# EAGLE design Combined_Board_BMI088 (EAGLE 9.6.2)
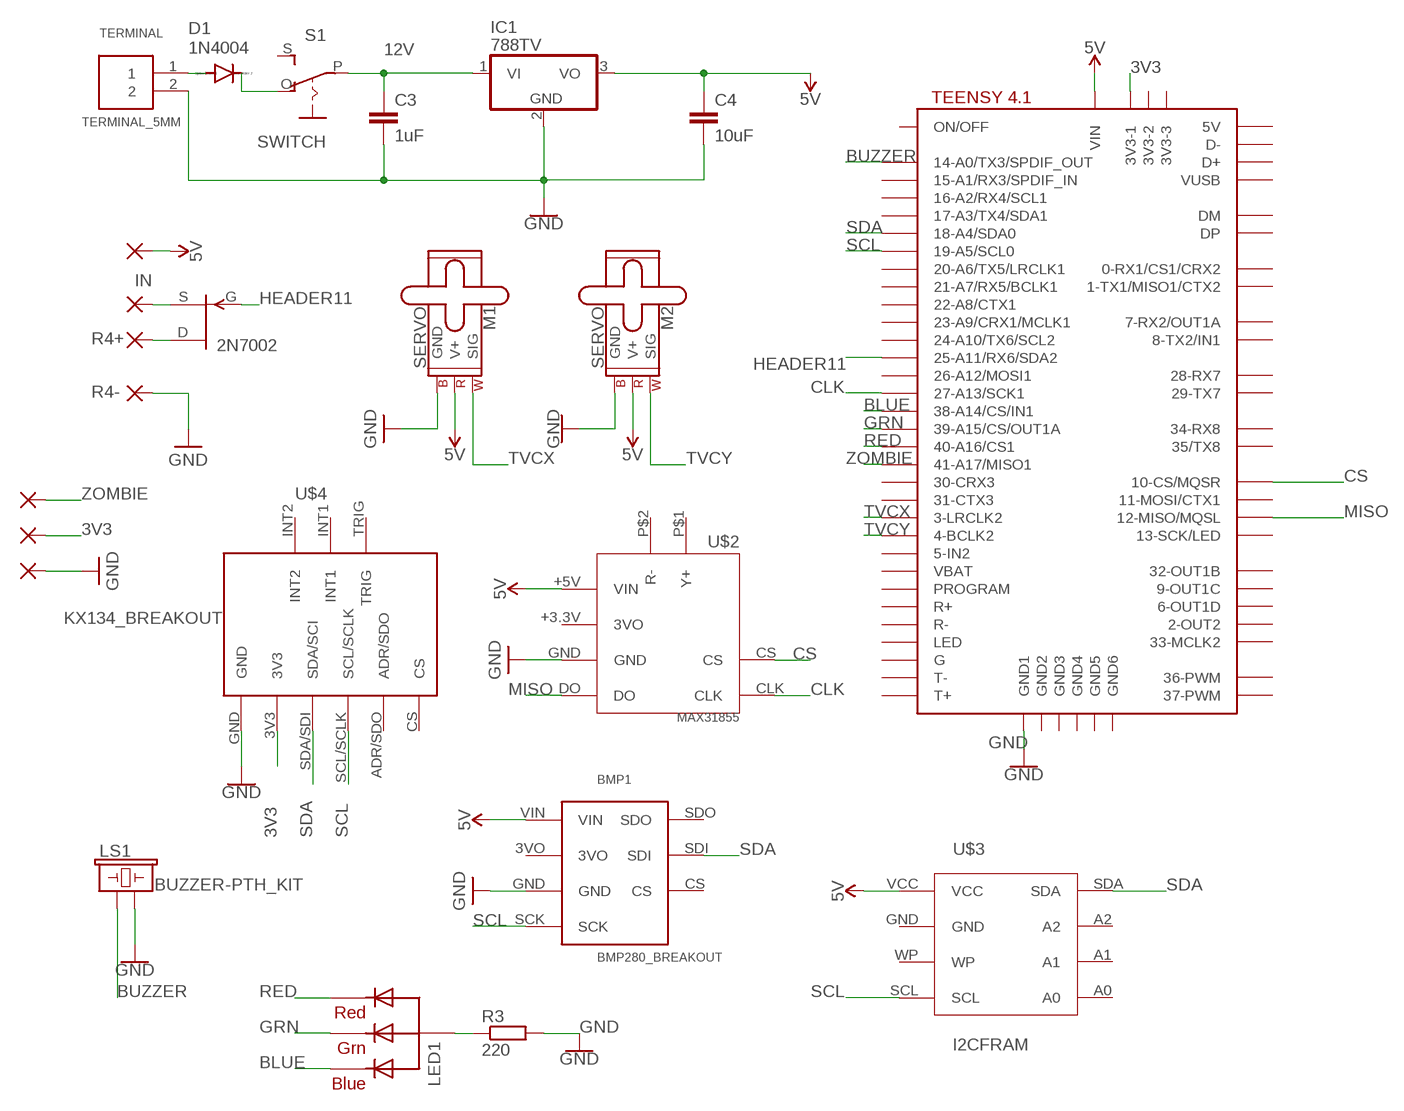
[diagram p0: schematic, sheet 1]

## Parts
2N7002  2N3819  [TO92]
5V  0  1,6/0,8  [1,6/0,8]
BMP1  BMP280_BREAKOUT  [BMP280_BREAKOUT]
C3  1uF  22PF-PTH-2.54MM-200V-5%  [CAP-PTH-2.54]
C4  10uF  22PF-PTH-2.54MM-200V-5%  [CAP-PTH-2.54]
D1  1N4004  [DO41-10]
IC1  788TV  [TO220V]
IN  0  1,6/0,8  [1,6/0,8]
LED1  RGBLED_CA-5MM  [LED5MMRGB]
LS1  BUZZER-PTH_KIT  [BUZZER-12MM-KIT]
M1  SERVO  [1X03]
M2  SERVO  [1X03]
R3  220  R-EU_0204/7  [0204/7]
R4+  0  1,6/0,8  [1,6/0,8]
R4-  0  1,6/0,8  [1,6/0,8]
S1  SWITCH  EG1218S  [EG1218]
TERMINAL  TERMINAL_5MM  [TERMINAL_5MM]
U$1  TEENSY41  [TEENSY41]
U$2  MAX31855  [MAX31855-BREAKOUT]
U$3  I2CFRAM  [I2CFRAM]
U$4  KX134_BREAKOUT  [KX134_BREAKOUT]
ZOMBIE  0  1,6/0,8  [1,6/0,8]
ZOMBIE3V3  0  1,6/0,8  [1,6/0,8]
ZOMBIEGND  0  1,6/0,8  [1,6/0,8]

## Nets
3V3: U$1.3V3-1 U$4.3V3 ZOMBIE3V3.1(P)
5V: 5V.1(P) BMP1.VIN C4.1 IC1.3(VO) M1.2(V+) M2.2(V+) U$1.VIN U$2.+5V(VIN) U$3.VCC
12V: C3.1 IC1.1(VI) S1.P
BLUE: LED1.4(BLUE) U$1.38-A14/CS/IN1
BUZZER: LS1.+ U$1.14-A0/TX3/SPDIF_OUT
CLK: U$1.27-A13/SCK1 U$2.CLK
CS: U$1.10-CS\MQSR(10-CS/MQSR) U$2.CS
GND: BMP1.GND C3.2 C4.2 IC1.2(GND) LS1.- M1.3(GND) M2.3(GND) R3.2 R4-.1(P) TERMINAL.2 U$1.GND1 U$2.GND U$4.GND ZOMBIEGND.1(P)
GRN: LED1.3(GREEN) U$1.39-A15/CS/OUT1A
HEADER11: 2N7002.2(G) U$1.25-A11/RX6/SDA2
IN: 2N7002.3(S) IN.1(P)
MISO: U$1.12-MISO/MQSL U$2.DO
N$1: LED1.2(VCC) R3.1
N$2: D1.A TERMINAL.1
N$3: 2N7002.1(D) R4+.1(P)
N$6: D1.C S1.O
RED: LED1.1(RED) U$1.40-A16/CS1
SCL: BMP1.SCK U$1.19-A5/SCL0 U$3.SCL U$4.SCL/SCLK
SDA: BMP1.SDI U$1.18-A4/SDA0 U$3.SDA U$4.SDA/SDI(SDA/SCI)
TVCX: M1.1(SIG) U$1.3-LRCLK2
TVCY: M2.1(SIG) U$1.4-BCLK2
ZOMBIE: U$1.41-A17/MISO1 ZOMBIE.1(P)
Unconnected: BMP1.3VO BMP1.CS BMP1.SDO S1.S U$1.0-RX1/CS1/CRX2 U$1.1-TX1/MISO1/CTX2 U$1.2-OUT2 U$1.3V3-2 U$1.3V3-3 U$1.5-IN2 U$1.6-OUT1D U$1.7-RX2/OUT1A U$1.8-TX2/IN2(8-TX2/IN1) U$1.9-OUT1C U$1.11-MOSI/CTX1 U$1.13-SCK/LED U$1.15-A1/RX3/SPDIF_IN U$1.16-A2/RX4/SCL1 U$1.17-A3/TX4/SDA1 U$1.20-A6/TX5/LRCLK1 U$1.21-A7/RX5/BCLK1 U$1.22-A8/CTX1 U$1.23-A9/CRX1/MCLK1 U$1.24-A10/TX6/SCL2 U$1.26-A12/MOSI1 U$1.28-RX7 U$1.29-TX7 U$1.30-CRX3 U$1.31-CTX3 U$1.32-OUT1B U$1.33-MCLK2 U$1.34-RX8 U$1.35-TX8(35/TX8) U$1.36-PWM U$1.37-PWM U$1.+5V(5V) U$1.D+ U$1.D- U$1.DM U$1.DP U$1.G U$1.GND2 U$1.GND3 U$1.GND4 U$1.GND5 U$1.GND6 U$1.LED U$1.ON/OFF U$1.PROGRAM U$1.R+ U$1.R- U$1.T+ U$1.T- U$1.VBAT U$1.VUSB U$2.+3.3V(3VO) U$2.P$1(Y+) U$2.P$2(R-) U$3.A0 U$3.A1 U$3.A2 U$3.GND U$3.WP U$4.ADR/SDO U$4.CS U$4.INT1 U$4.INT2 U$4.TRIG

## Library data of the parts
2N7002 = transistor-fet:2N3819: N-Channel Junction FET
5V IN R4+ R4- ZOMBIE ZOMBIE3V3 ZOMBIEGND = wirepad:1,6/0,8: THROUGH-HOLE PAD
BMP1 = BMP280_BREAKOUT:BMP280_BREAKOUT: BMP280 Breakout Board From AdaFruit https://github.com/adafruit/Adafruit-BMP280-Breakout-PCB
C3 C4 = SparkFun-Capacitors:22PF: 22pF ceramic capacitors A capacitor is a passive two-terminal electrical component used to store electrical energy temporarily in an electric field.; PROD_ID: CAP-09128; VALUE: 22pF
D1 = diode:1N4004: DIODE general purpose rectifier, 1 A
IC1 = linear:78*: Positive VOLTAGE REGULATOR Source: http://cache.national.com/ds/LM/LM78L05.pdf http://www.fairchildsemi.com/ds/LM/LM7805.pdf
LED1 = adafruit:RGBLED_CA: RGB LED, common-anode 5MM Staggered pins 5mm Piranha package http://www.ladyada.net/library/pcb/eaglelibrary.html
LS1 = SparkFun-Electromechanical:BUZZER: Buzzer Small round buzzers that operate around the audible 2kHz range. You can use these as speakers to create simple music or user interfaces. Variant Overview: PTH - Mini Speaker - PC Mount 12mm 2.048kHz <https://www.sparkfun.com/products/7950> PTH_KIT - Mini Speaker - PC Mount 12mm 2.048kHz <https://www.sparkfun.com/products/7950> KIT simplifies soldering by adding stop mask to one side of the pads. PTH_NO_SILK - Mini Speaker - PC Mount 12mm 2.048kHz <https://www.sparkfun.com/products/7950> No silkscreen indicator of buzzer outline. PTH_KIT_NO_SILK - Mini Speaker - PC Mount 12mm 2.048kHz <https://www.sparkfun.com/products/7950> KIT package w/o silkscreen SMD - Buzzer Audio Magnetic (CCV-084B16) SMD buzzer used on, e.g. the LilyPad Buzzer <https://www.sparkfun.com/products/8463> and RFID USB Reader <https://www.sparkfun.com/products/9963>. SMD_KIT - Buzzer Audio Magnetic (CCV-084B16) SMD Buzzer with elongated pins to make soldering easier. Used on the SparkFun Simon Says - Surface Mount Soldering Kit <https://www.sparkfun.com/products/10935>. SMD-SQUARE - Buzzer Audio Magnetic (COMP-15701) SMT square buzzer with one chamfered corner.; PROD_ID: COMP-08253; SF_SKU: COM-07950
M1 M2 = SparkFun-Electromechanical:SERVO: Servo Motor 3-pin connector for a standard servo motor (voltage supply, ground, and control signal.) SparkFun Products Servo - Generic (Sub-Micro Size) <https://www.sparkfun.com/products/9065> (ROB-09065) Servo - Generic High Torque Continuous Rotation (Standard Size) <https://www.sparkfun.com/products/9347> (ROB-09347) Servo - Generic High Torque (Standard Size) <https://www.sparkfun.com/products/11965> (ROB-11965)
R3 = rcl:R-EU_: RESISTOR, European symbol; SPICEPREFIX: R
S1 = adafruit:EG1218: SLIDING SWITCH 0.1" spacing through hole, vertical SPDT slide switch http://www.ladyada.net/library/pcb/eaglelibrary.html
TERMINAL = TERMINAL_5MM:TERMINAL_5MM
U$1 = teensy:TEENSY41
U$2 = max31855:MAX31855
U$3 = I2CFRAM:I2CFRAM
U$4 = KX134_BREAKOUT:KX134_BREAKOUT: KX134 Breakout Board From SparkFun https://www.sparkfun.com/products/17589

## Board
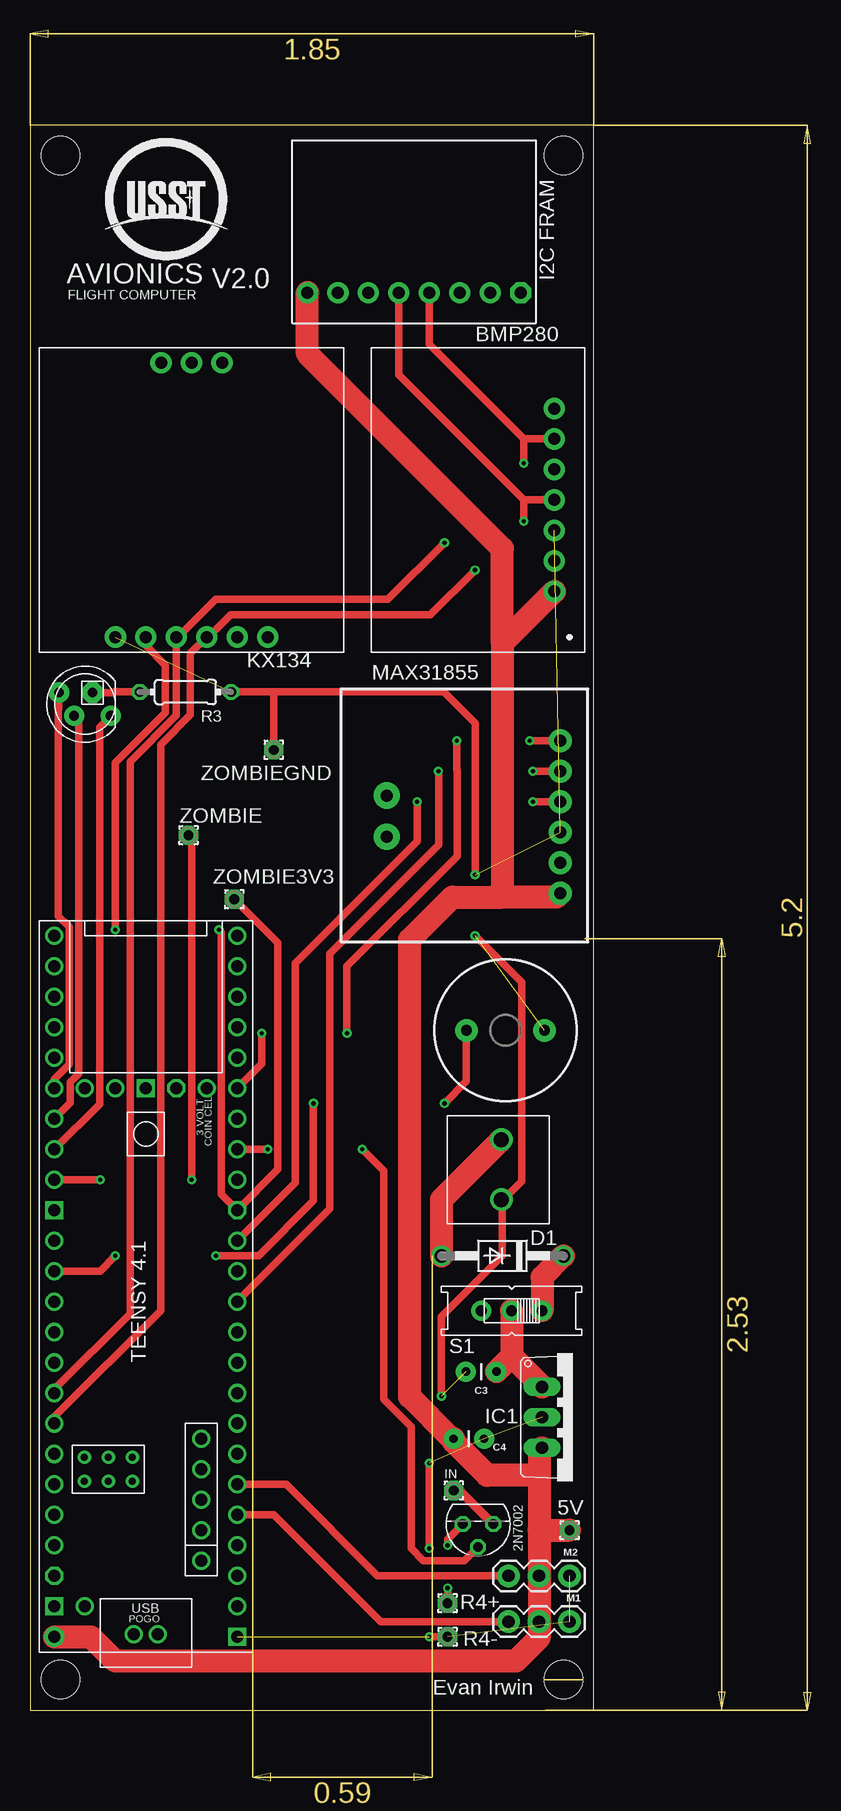
[diagram p1: board, top side]
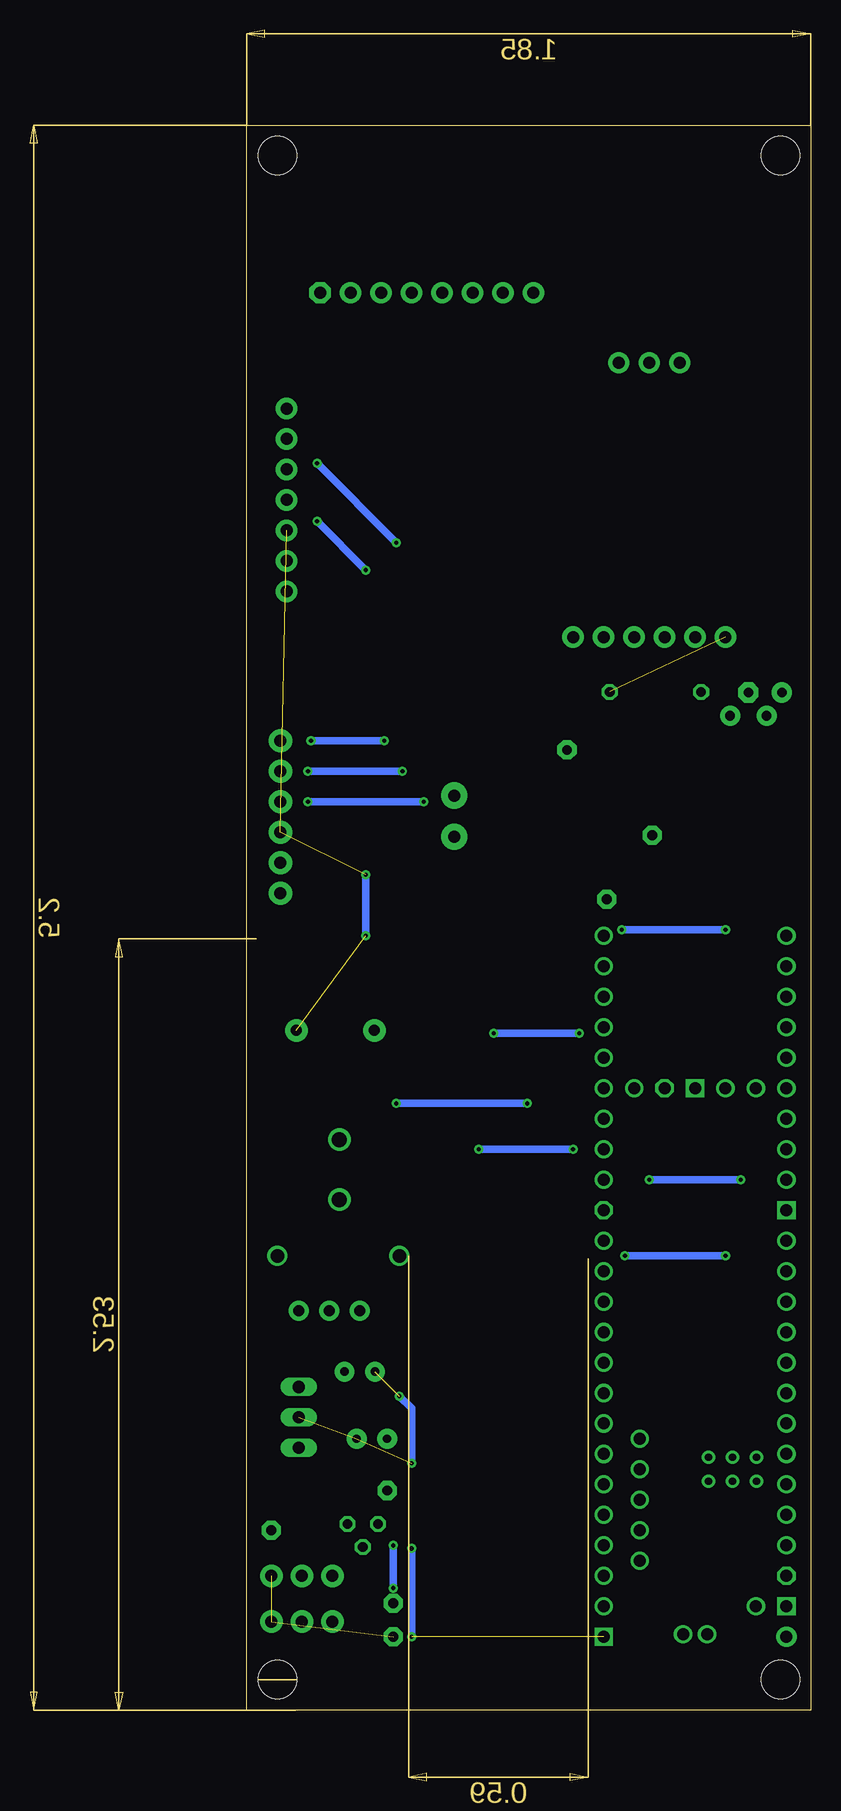
[diagram p2: board, bottom side, seen from below]

Size 46.99 x 132.08 mm. Coordinates in mm from the lower left corner, seen from the top.
Outline: 0,0 46.99,0 46.99,132.08 0,132.08 0,0
Copper layers (1*16): Top 0.035mm / dielectric 1.5mm / Bottom 0.035mm
Design rules "default": minimum track width 6mil, minimum drill 0.35mm, track to track 6mil, track to pad 6mil, pad to pad 6mil, via to via 6mil, smd to smd 6mil, copper to edge 40mil, drill to drill 6mil, minimum pad ring 10mil, minimum via ring 8mil, stop-mask expansion 4mil, vias tented up to drill 0mil, thermal gap 10mil
Holes 3.17 mm at 44.45,129.54 2.54,129.54 44.45,2.54 2.54,2.54

### Footprints (pad centres in the part's own frame; a part is rotated, then mirrored left to right if it is on the bottom)
TO92 = drill 0.813 octagon: 1 1.27,0; 2 0,1.905; 3 -1.27,0
1,6/0,8 = drill 0.813 pad 1.6 octagon: 1 0,0
BMP280_BREAKOUT = drill 1 pad 1.778: 3VO 7.62,2.54; CS 20.32,2.54; GND 10.16,2.54; SCK 12.7,2.54; SDI 17.78,2.54; SDO 15.24,2.54; VIN 5.08,2.54
CAP-PTH-2.54 = drill 0.7 pad 1.651: 1 -1.27,0; 2 1.27,0
DO41-10 = drill 1.118: A 5.08,0; C -5.08,0
TO220V = drill 1.016 long: 1 -2.54,-2.54; 2 0,-2.54; 3 2.54,-2.54
LED5MMRGB = drill 0.8 pad 1.676: 1 -2.159,0.968; 3 0.889,0.968; 4 2.159,-0.968 | drill 0.8 pad 1.676 octagon: 2 -0.635,-0.968
BUZZER-12MM-KIT = drill 0.9 pad 1.88: + 3.25,0; - -3.25,0
1X03 = drill 1.016 pad 1.88: 1 0,0; 2 2.54,0; 3 5.08,0
0204/7 = drill 0.813 octagon: 1 -3.81,0; 2 3.81,0
EG1218 = drill 0.9 pad 1.676: O -2.54,0; P 0,0; S 2.54,0
TERMINAL_5MM = drill 1.25: 1 2,5; 2 7,5
TEENSY41 = drill 1: 0-RX1/CS1/CRX2 -27.94,-7.62; 1-TX1/MISO1/CTX2 -25.4,-7.62; 2-OUT2 -22.86,-7.62; 3-LRCLK2 -20.32,-7.62; 4-BCLK2 -17.78,-7.62; 5-IN2 -15.24,-7.62; 6-OUT1D -12.7,-7.62; 7-RX2/OUT1A -10.16,-7.62; 8-TX2/IN2 -7.62,-7.62; 9-OUT1C -5.08,-7.62; 10-CS\MQSR -2.54,-7.62; 11-MOSI/CTX1 0,-7.62; 12-MISO/MQSL 2.54,-7.62; 13-SCK/LED 2.54,7.62; 14-A0/TX3/SPDIF_OUT 0,7.62; 15-A1/RX3/SPDIF_IN -2.54,7.62; 16-A2/RX4/SCL1 -5.08,7.62; 17-A3/TX4/SDA1 -7.62,7.62; 18-A4/SDA0 -10.16,7.62; 19-A5/SCL0 -12.7,7.62; 20-A6/TX5/LRCLK1 -15.24,7.62; 21-A7/RX5/BCLK1 -17.78,7.62; 22-A8/CTX1 -20.32,7.62; 23-A9/CRX1/MCLK1 -22.86,7.62; 24-A10/TX6/SCL2 7.62,-7.62; 25-A11/RX6/SDA2 10.16,-7.62; 26-A12/MOSI1 12.7,-7.62; 27-A13/SCK1 15.24,-7.62; 28-RX7 17.78,-7.62; 29-TX7 20.32,-7.62; 30-CRX3 22.86,-7.62; 31-CTX3 25.4,-7.62; 32-OUT1B 27.94,-7.62; 33-MCLK2 27.94,7.62; 34-RX8 25.4,7.62; 35-TX8 22.86,7.62; 36-PWM 20.32,7.62; 37-PWM 17.78,7.62; 38-A14/CS/IN1 15.24,7.62; 39-A15/CS/OUT1A 12.7,7.62; 40-A16/CS1 10.16,7.62; 41-A17/MISO1 7.62,7.62; +5V -24.13,-4.62; D+ -30.25,-1; D- -30.25,1; DM -21.59,-4.62; DP -19.05,-4.62; GND4 -16.51,-4.62; GND5 -13.97,-4.62; ON/OFF 15.24,5.08; PROGRAM 15.24,2.54; VBAT 15.24,-5.08; VUSB -27.94,5.08 | drill 1 octagon: 3V3-1 5.08,-7.62; 3V3-2 15.24,-2.54; 3V3-3 -25.4,7.62 | drill 0.6: G -15.51,3.12; LED -17.51,3.12; R+ -17.51,5.12; R- -15.51,5.12; T+ -15.51,1.12; T- -17.51,1.12 | drill 1 square: GND1 -30.48,-7.62; GND2 15.24,0; GND3 5.08,7.62; GND6 -27.94,7.62 | drill 1 pad 1.676: VIN -30.48,7.62
MAX31855-BREAKOUT = drill 1 pad 1.93: +3.3V 6.35,2.032; +5V 3.81,2.032; CLK 16.51,2.032; CS 13.97,2.032; DO 11.43,2.032; GND 8.89,2.032 | drill 1 pad 2.184: P$1 11.938,16.51; P$2 8.509,16.51
I2CFRAM = drill 1 pad 1.778 octagon: A0 19.05,2.54 | drill 1 pad 1.778: A1 16.51,2.54; A2 13.97,2.54; GND 3.81,2.54; SCL 8.89,2.54; SDA 11.43,2.54; VCC 1.27,2.54; WP 6.35,2.54
KX134_BREAKOUT = drill 1 pad 1.778: 3V3 8.89,1.27; ADR/SDO 16.51,1.27; CS 19.05,1.27; GND 6.35,1.27; INT1 12.7,24.13; INT2 10.16,24.13; SCL/SCLK 13.97,1.27; SDA/SDI 11.43,1.27; TRIG 15.24,24.13

### Placement (x,y rotation side)
2N7002  37.34,15.49 180 top
5V  44.96,14.99 0 top
BMP1  46.23,88.14 90 top
C3  37.59,28.19 180 top
C4  36.58,22.61 0 top
D1  39.37,37.85 180 top
IC1  45.21,24.38 270 top
IN  35.31,18.29 0 top
LED1  4.57,83.82 180 top
LS1  39.62,56.64 180 top
M1  39.88,7.37 0 top
M2  39.88,11.18 0 top
R3  12.95,84.84 0 top
R4+  34.8,8.89 0 top
R4-  34.8,6.1 0 top
S1  40.13,33.27 180 top
TERMINAL  34.29,49.53 270 top
U$1  9.65,36.58 90 top
U$2  46.23,64.26 90 top
U$3  21.84,115.57 0 top
U$4  0.76,88.14 0 top
ZOMBIE  13.21,72.9 0 top
ZOMBIE3V3  17.02,67.56 0 top
ZOMBIEGND  20.32,80.01 0 top

### Tracks (layer width: path | path; a pad name or v marks a point on that pad's centre or on a via)
3V3  (via drill 0.35)
  Top 0.635: v15.75,65.02 15.96,64.82 15.96,42.97 U$1.3V3-1 20.66,45.04 20.66,63.92 ZOMBIE3V3.1 | U$4.3V3 9.65,88.72 11.29,87.08 11.29,83.1 7.11,78.92 v7.11,65.02
  Bottom 0.635: v15.75,65.02 v7.11,65.02
5V
  Top 1.905: IC1.3 42.42,21.59 42.42,19.56 | 42.42,19.56 42.42,14.99 | 42.42,14.99 M2.2 M1.2 42.43,7.35 42.43,6.01 40.48,4.06 7.11,4.06 5.08,6.1 U$1.VIN | 39.36,67.75 39.37,67.75 39.37,88.9 | BMP1.VIN 39.37,88.9 | U$2.+5V 43.87,67.75 39.36,67.75 | 42.42,19.56 38.1,19.56 35.31,22.35 C4.1 35.12,22.61 31.63,26.09 31.63,64.19 35.19,67.75 39.36,67.75 | 39.37,88.9 39.37,96.77 23.11,113.03 U$3.VCC | 42.42,14.99 5V.1
12V
  Top 1.905: S1.P 40.13,29.46 | 40.13,29.46 IC1.1 | C3.1 40.13,29.46
BLUE
  Top 0.635: LED1.4 2.41,83.43 2.38,83.39 2.38,66.16 3.26,65.28 3.26,53.8 2.03,52.58 U$1.38-A14/CS/IN1
BUZZER  (via drill 0.35)
  Top 0.635: LS1.+ 36.37,52.38 v34.54,50.55 | v23.62,50.55 23.62,42.42 19.05,37.85 v15.49,37.85 | v7.11,37.85 5.84,36.58 U$1.14-A0/TX3/SPDIF_OUT
  Bottom 0.635: v15.49,37.85 v7.11,37.85 | v23.62,50.55 v34.54,50.55
CLK  (via drill 0.35)
  Top 0.635: U$1.27-A13/SCK1 19.3,53.85 v19.3,56.39 | v26.42,56.39 26.42,61.98 35.59,71.14 35.59,78.3 35.56,78.33 v35.56,80.77 | v41.66,80.77 U$2.CLK
  Bottom 0.635: v19.3,56.39 v26.42,56.39 | v35.56,80.77 v41.66,80.77
CS  (via drill 0.35)
  Top 0.635: U$1.10-CS\MQSR 17.27,34.08 24.98,41.79 24.98,63.03 34.07,72.12 34.07,78.19 v34.04,78.23 | v41.91,78.23 U$2.CS
  Bottom 0.635: v34.04,78.23 v41.91,78.23
GND  (via drill 0.35)  (10 unrouted)
  Top 0.635: v37.08,64.52 40.97,60.63 40.97,44.07 39.43,42.53 TERMINAL.2 39.37,42.45 39.37,37.85 34.29,32.77 v34.29,26.16 | v37.08,69.6 37.08,82.22 34.47,84.84 20.32,84.84 | 20.32,84.84 R3.2 | R4-.1 v33.27,6.1 | v33.27,13.46 v33.27,20.57 | ZOMBIEGND.1 20.32,84.84
  Bottom 0.635: v37.08,69.6 v37.08,64.52 | v33.27,13.46 v33.27,6.1 | v33.27,20.57 33.27,25.15 v34.29,26.16
GRN
  Top 0.635: LED1.3 3.81,82.85 4.04,82.62 4.04,53.02 3.35,52.32 3.35,50.59 U$1.39-A15/CS/OUT1A
HEADER11  (via drill 0.35)
  Top 0.635: 2N7002.2 36.2,12.45 32.77,12.45 31.75,13.46 31.75,23.62 29.46,25.91 29.46,44.96 v27.69,46.74 | v19.81,46.74 U$1.25-A11/RX6/SDA2
  Bottom 0.635: v19.81,46.74 v27.69,46.74
IN
  Top 0.762: IN.1 35.81,18.29 2N7002.3
MISO  (via drill 0.35)
  Top 0.635: U$1.12-MISO/MQSL 22.1,43.94 22.1,62.23 32.26,72.39 v32.26,75.69 | v41.91,75.69 U$2.DO
  Bottom 0.635: v32.26,75.69 v41.91,75.69
N$1
  Top 0.635: LED1.2 6.99,84.79 7.03,84.84 R3.1
N$2
  Top 1.905: TERMINAL.1 34.29,42.53 D1.A
N$3  (via drill 0.35)
  Top 0.635: 2N7002.1 34.8,14.22 v34.8,13.72 | R4+.1 v34.8,10.16
  Bottom 0.635: v34.8,13.72 v34.8,10.16
N$6
  Top 1.905: S1.O 42.67,36.07 D1.C
RED
  Top 0.635: LED1.1 5.8,81.92 5.8,50.5 U$1.40-A16/CS1
SCL  (via drill 0.35)
  Top 0.635: U$1.19-A5/SCL0 2.03,24.43 10.88,33.27 10.88,80.46 13.37,82.95 13.37,88.05 U$4.SCL/SCLK 14.84,89.41 16.71,91.28 33.36,91.28 v37.08,95 | U$3.SCL 30.73,111.25 41.15,100.84 | 41.15,100.84 BMP1.SCK | 41.15,100.84 v41.15,99.06
  Bottom 0.635: v41.15,99.06 v37.08,95
SDA  (via drill 0.35)
  Top 0.635: U$1.18-A4/SDA0 2.03,26.72 8.34,33.02 8.34,79.03 12.19,82.89 U$4.SDA/SDI 12.3,89.41 15.46,92.57 29.83,92.57 v34.54,97.28 | U$3.SDA 33.27,113.79 41.15,105.92 | 41.15,105.92 BMP1.SDI | 41.15,105.92 v41.15,103.89
  Bottom 0.635: v41.15,103.89 v34.54,97.28
TVCX
  Top 0.635: U$1.3-LRCLK2 20.32,16.26 29.21,7.37 M1.1
TVCY
  Top 0.635: U$1.4-BCLK2 21.34,18.8 28.96,11.18 M2.1
ZOMBIE  (via drill 0.35)
  Top 0.635: U$1.41-A17/MISO1 v5.84,44.2 | ZOMBIE.1 13.46,72.64 v13.46,44.2
  Bottom 0.635: v5.84,44.2 v13.46,44.2

### Text on the board
tPlace: AVIONICS | I2C FRAM | FLIGHT COMPUTER | V2.0 | BMP280 | KX134 | MAX31855
tNames: Evan Irwin